# EAGLE schematic Mega_interface (EAGLE 9.0.1)
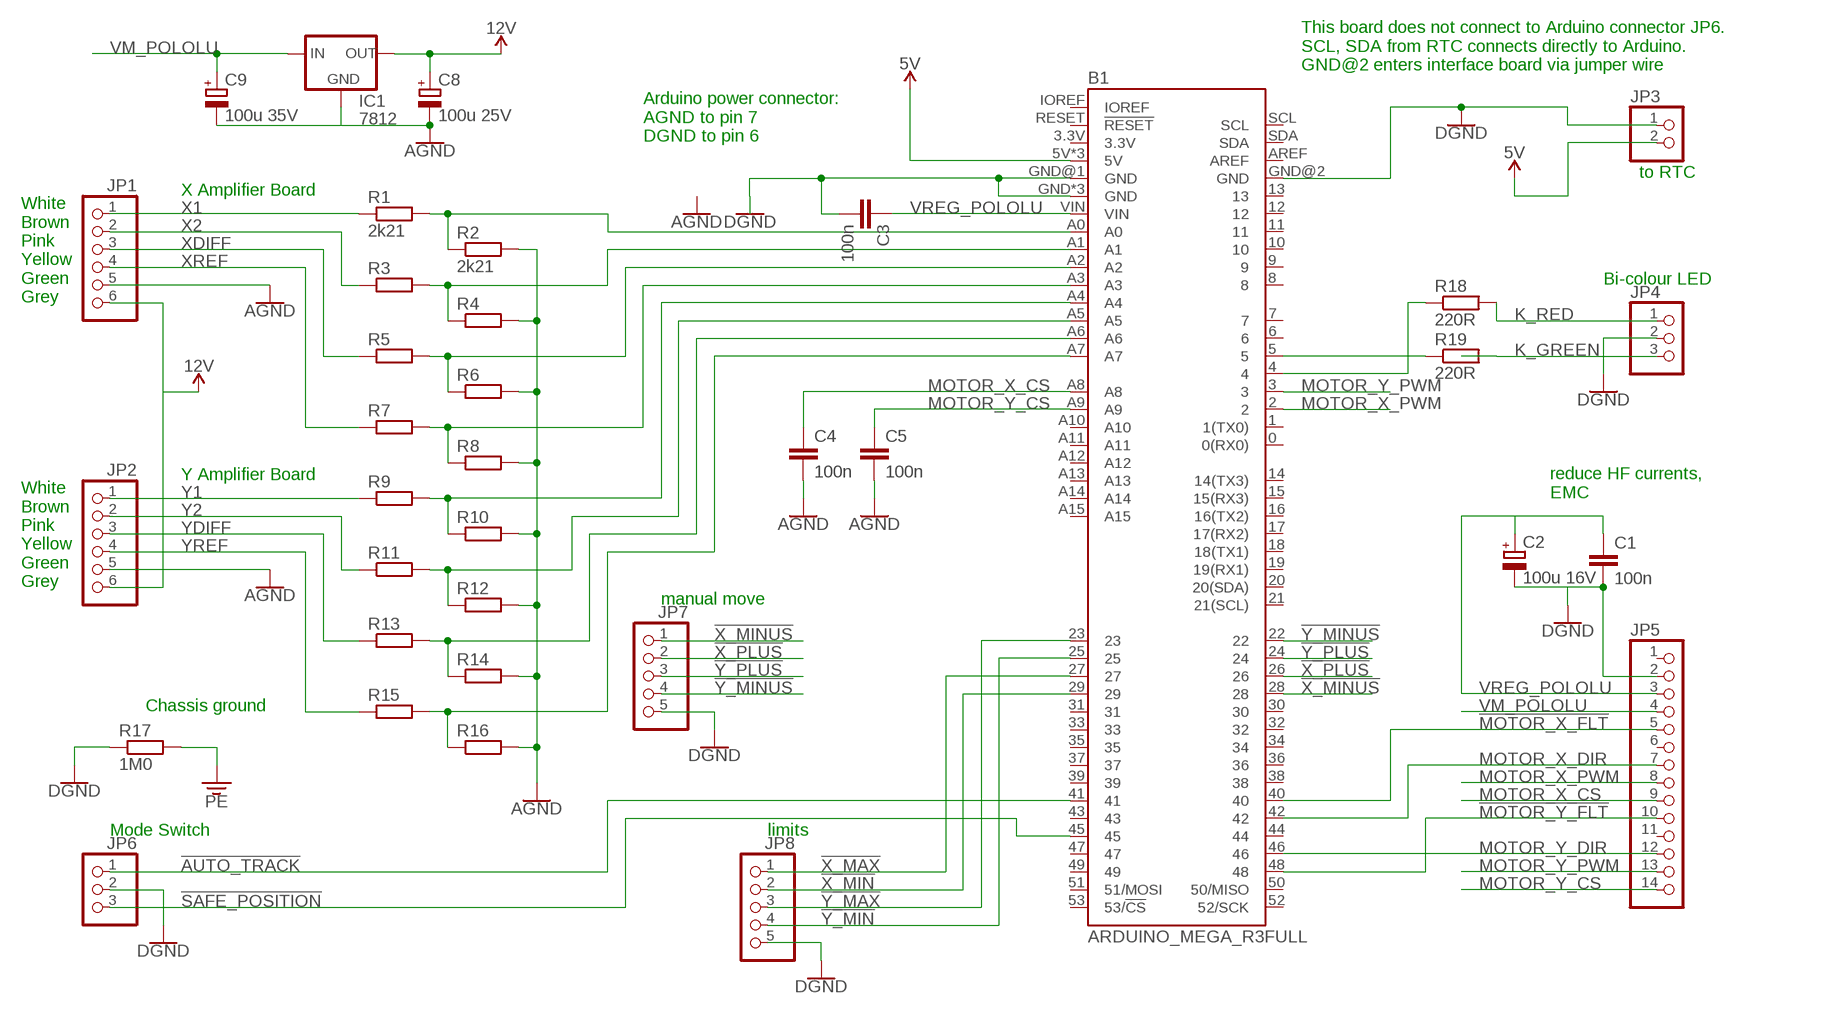
[diagram p0: schematic, sheet 1]

## Parts
B1  ARDUINO_MEGA_R3FULL  [ARDUINO_MEGA_NO_SILK]
C1  100n  C-EU050-024X044  [C050-024X044]
C2  100u 16V  CPOL-EUB45181B  [B45181B]
C3  100n  C-EU050-024X044  [C050-024X044]
C4  100n  C-EU050-024X044  [C050-024X044]
C5  100n  C-EU050-024X044  [C050-024X044]
C8  100u 25V  CPOL-EUB45181B  [B45181B]
C9  100u 35V  CPOL-EUB45181B  [B45181B]
IC1  7812  78XXL  [78XXL]
JP1  PINHD-1X6  [1X06]
JP2  PINHD-1X6  [1X06]
JP3  PINHD-1X2  [1X02]
JP4  PINHD-1X3  [1X03]
JP5  PINHD-1X14  [1X14]
JP6  PINHD-1X3  [1X03]
JP7  PINHD-1X5  [1X05]
JP8  PINHD-1X5  [1X05]
R1  2k21  R-EU_0207/10  [0207/10]
R2  2k21  R-EU_0207/10  [0207/10]
R3  R-EU_0207/10  [0207/10]
R4  R-EU_0207/10  [0207/10]
R5  R-EU_0207/10  [0207/10]
R6  R-EU_0207/10  [0207/10]
R7  R-EU_0207/10  [0207/10]
R8  R-EU_0207/10  [0207/10]
R9  R-EU_0207/10  [0207/10]
R10  R-EU_0207/10  [0207/10]
R11  R-EU_0207/10  [0207/10]
R12  R-EU_0207/10  [0207/10]
R13  R-EU_0207/10  [0207/10]
R14  R-EU_0207/10  [0207/10]
R15  R-EU_0207/10  [0207/10]
R16  R-EU_0207/10  [0207/10]
R17  1M0  R-EU_0207/10  [0207/10]
R18  220R  R-EU_0207/10  [0207/10]
R19  220R  R-EU_0207/10  [0207/10]

## Nets
3.3V: R17.2 ; supply symbol labelled PE
5V: B1.5V B1.5V@1(5V) B1.5V@2(5V) JP3.2
12V: C8.+ IC1.OUT JP1.6 JP2.6
!AUTO_TRACK: B1.41 JP6.1
!MOTOR_X_FLT: B1.40 JP5.5
!MOTOR_Y_FLT: B1.48 JP5.10
!SAFE_POSITION: B1.45 JP6.3
!X_MAX: B1.27 JP8.1
!X_MIN: B1.29 JP8.2
!X_MINUS: B1.28 JP7.1
!X_PLUS: B1.26 JP7.2
!Y_MAX: B1.23 JP8.3
!Y_MIN: B1.25 JP8.4
!Y_MINUS: B1.22 JP7.4
!Y_PLUS: B1.24 JP7.3
AGND: C4.2 C5.2 C8.- C9.- IC1.GND JP1.5 JP2.5 R2.2 R4.2 R6.2 R8.2 R10.2 R12.2 R14.2 R16.2
GND: B1.GND B1.GND@1(GND) B1.GND@2(GND) B1.GND@3(GND) B1.GND@4(GND) C1.2 C2.- C3.2 JP3.1 JP4.2 JP5.2 JP6.2 JP7.5 JP8.5 R17.1 ; supply symbol labelled DGND
K_GREEN: JP4.3 R19.2
K_RED: JP4.1 R18.2
MOTOR_X_CS: B1.A8 C4.1 JP5.9
MOTOR_X_DIR: B1.42 JP5.7
MOTOR_X_PWM: B1.2 JP5.8
MOTOR_Y_CS: B1.A9 C5.1 JP5.14
MOTOR_Y_DIR: B1.46 JP5.12
MOTOR_Y_PWM: B1.3 JP5.13
N$1: B1.5 R19.1
N$2: B1.A0 R1.2 R2.1
N$3: B1.A1 R3.2 R4.1
N$4: B1.A2 R5.2 R6.1
N$5: B1.A3 R7.2 R8.1
N$6: B1.A4 R9.2 R10.1
N$7: B1.A5 R11.2 R12.1
N$8: B1.A6 R13.2 R14.1
N$9: B1.4 R18.1
N$10: B1.A7 R15.2 R16.1
VM_POLOLU: C9.+ IC1.IN JP5.4
VREG_POLOLU: B1.VIN C1.1 C2.+ C3.1 JP5.3
X1: JP1.1 R1.1
X2: JP1.2 R3.1
XDIFF: JP1.3 R5.1
XREF: JP1.4 R7.1
Y1: JP2.1 R9.1
Y2: JP2.2 R11.1
YDIFF: JP2.3 R13.1
YREF: JP2.4 R15.1
Unconnected: B1.0(0(RX0)) B1.1(1(TX0)) B1.3.3V B1.6 B1.7 B1.8 B1.9 B1.10 B1.11 B1.12 B1.13 B1.14(14(TX3)) B1.15(15(RX3)) B1.16(16(TX2)) B1.17(17(RX2)) B1.18(18(TX1)) B1.19(19(RX1)) B1.20(20(SDA)) B1.21(21(SCL)) B1.30 B1.31 B1.32 B1.33 B1.34 B1.35 B1.36 B1.37 B1.38 B1.39 B1.43 B1.44 B1.47 B1.49 B1.50(50/MISO) B1.51(51/MOSI) B1.52(52/SCK) B1.53(53/!CS) B1.A10 B1.A11 B1.A12 B1.A13 B1.A14 B1.A15 B1.AREF B1.IOREF B1.RESET(!RESET) B1.SCL B1.SDA JP5.1 JP5.6 JP5.11

## Notes on the sheet
- This board does not connect to Arduino connector JP6.
  SCL, SDA from RTC connects directly to Arduino.
  GND@2 enters interface board via jumper wire
- Arduino power connector:
  AGND to pin 7
  DGND to pin 6
- to RTC
- X Amplifier Board
- Bi-colour LED
- White
  Brown
  Pink
  Yellow
  Green
  Grey
- Y Amplifier Board
- reduce HF currents,
  EMC
- White
  Brown
  Pink
  Yellow
  Green
  Grey
- manual move
- Chassis ground
- Mode Switch | limits

## Library data of the parts
B1 = SparkFun-Boards:ARDUINO_MEGA_R3: Arduino Mega R3 ATmega2560 R3 compatible footprint. SparkFun Products: Arduino Mega 2560 R3 <https://www.sparkfun.com/products/11061>
C1 C3-C5 = rcl:C-EU: CAPACITOR, European symbol; SPICEPREFIX: C
C2 C8 C9 = rcl:CPOL-EU: POLARIZED CAPACITOR, European symbol; SPICEPREFIX: C
IC1 = v-reg:78XXL: VOLTAGE REGULATOR
JP1 JP2 = pinhead:PINHD-1X6: PIN HEADER
JP3 = pinhead:PINHD-1X2: PIN HEADER
JP4 JP6 = pinhead:PINHD-1X3: PIN HEADER
JP5 = pinhead:PINHD-1X14: PIN HEADER
JP7 JP8 = pinhead:PINHD-1X5: PIN HEADER
R1-R19 = rcl:R-EU_: RESISTOR, European symbol; SPICEPREFIX: R